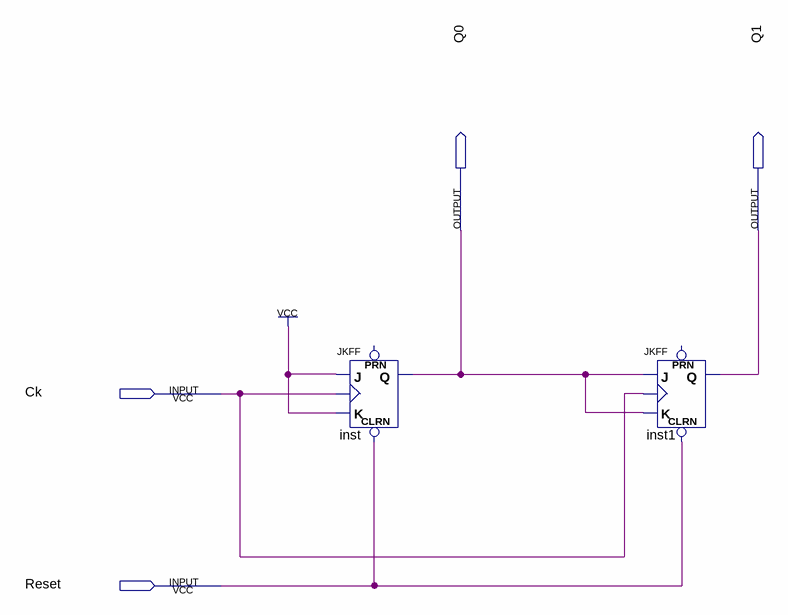
[diagram p0: schematic sheet]
// Quartus schematic Numarator0_3.bdf as structural Verilog: 2 symbols, 4 pins
module Numarator0_3 (
  input  Ck,
  input  Reset,
  output Q0,
  output Q1
);

  JKFF inst (.CLRN(Reset), .K(1'b1), .J(1'b1), .CLK(Ck), .Q(Q0));  // open: PRN
  JKFF inst1 (.CLRN(Reset), .K(Q0), .J(Q0), .CLK(Ck), .Q(Q1));  // open: PRN
endmodule
